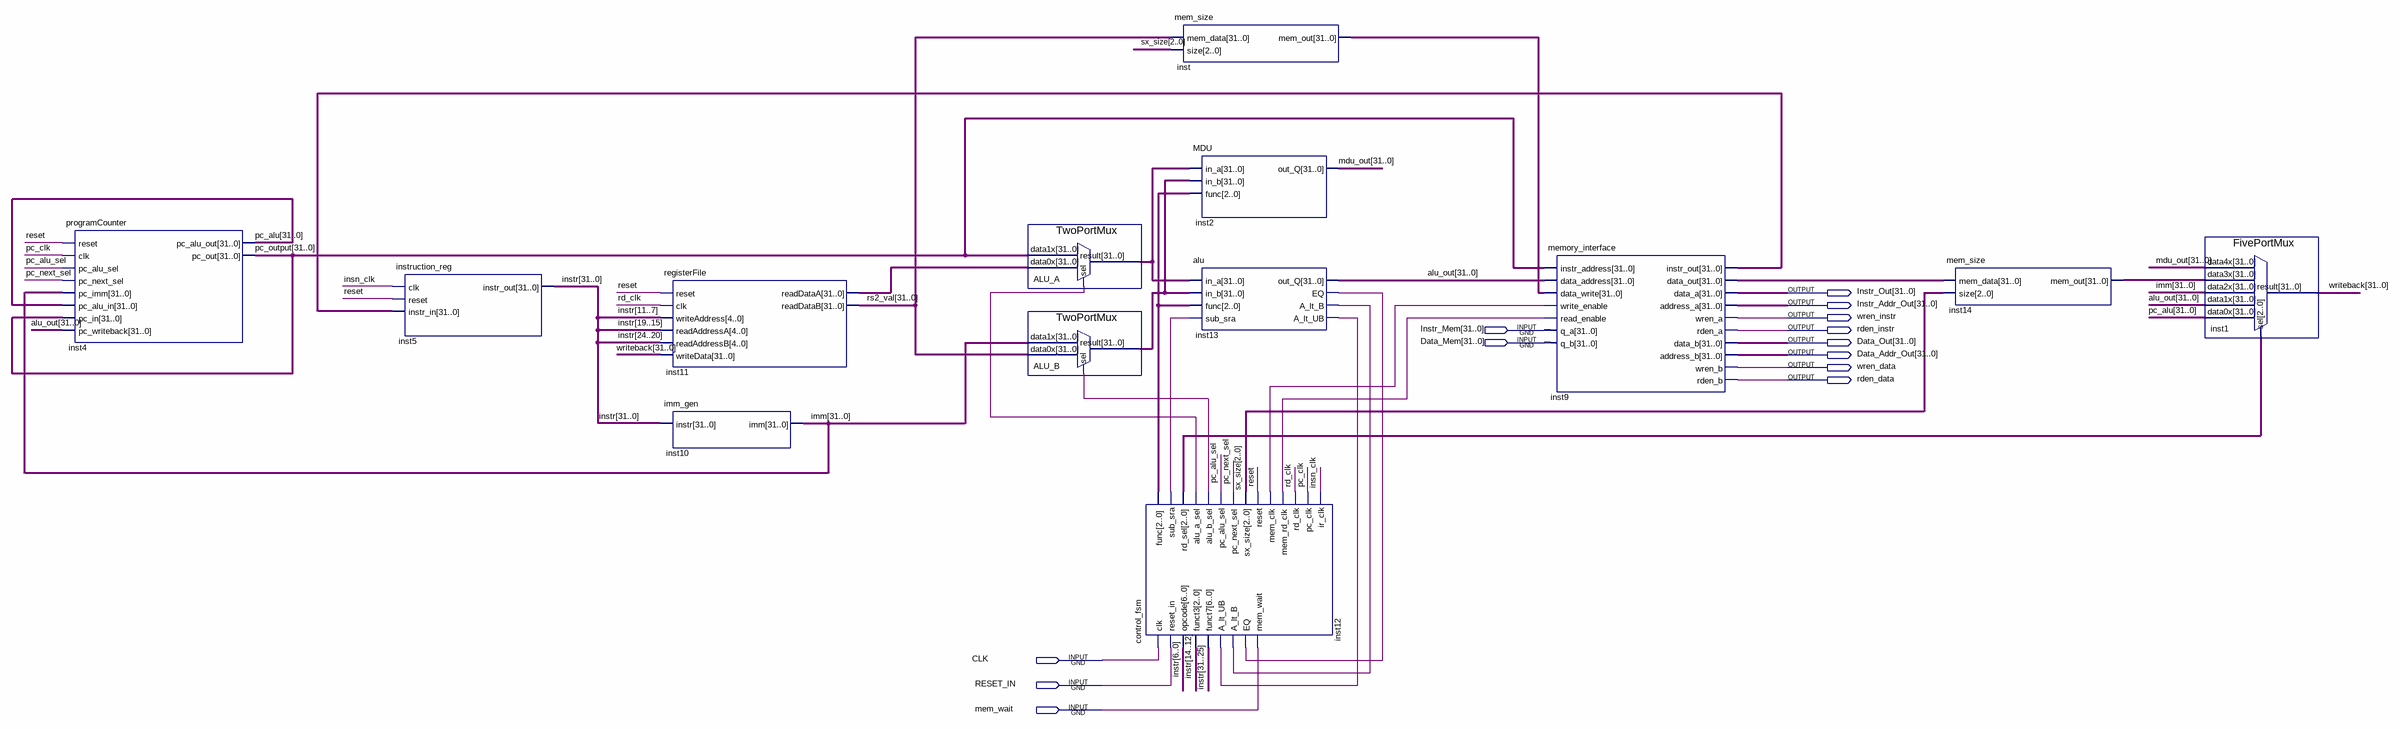
[diagram p0: schematic sheet]
// Quartus schematic NeuroRisc.bdf as structural Verilog: 13 symbols, 13 pins
module NeuroRisc (
  input  [31:0] Instr_Mem,
  input  [31:0] Data_Mem,
  input  CLK,
  input  RESET_IN,
  input  mem_wait,
  output [31:0] Instr_Out,
  output [31:0] Instr_Addr_Out,
  output wren_instr,
  output rden_instr,
  output [31:0] Data_Out,
  output [31:0] Data_Addr_Out,
  output wren_data,
  output rden_data
);

  wire insn_clk, inst12_alu_a_sel, inst12_alu_b_sel, inst12_mem_clk, inst12_mem_rd_clk, inst12_sub_sra,
       inst13_a_lt_b, inst13_a_lt_ub, inst13_eq, pc_alu_sel, pc_clk, pc_next_sel, rd_clk, reset;
  wire [2:0] inst12_func, inst12_rd_sel, sx_size;
  wire [31:0] ALU_A_result, ALU_B_result, alu_out, imm, inst9_data_out, inst9_instr_out, inst11_readdataa,
       inst14_mem_out, inst_mem_out, instr, mdu_out, pc_alu, pc_output, rs2_val, writeback;

  programCounter inst4 (
    .reset(reset), .clk(pc_clk), .pc_alu_sel(pc_alu_sel), .pc_next_sel(pc_next_sel), .pc_imm(imm),
    .pc_alu_in(pc_alu), .pc_in(pc_output), .pc_writeback(alu_out), .pc_alu_out(pc_alu), .pc_out(pc_output));
  instruction_reg inst5 (.clk(insn_clk), .reset(reset), .instr_in(inst9_instr_out), .instr_out(instr));
  registerFile inst11 (
    .reset(reset), .clk(rd_clk), .writeAddress(instr[11:7]), .readAddressA(instr[19:15]),
    .readAddressB(instr[24:20]), .writeData(writeback), .readDataA(inst11_readdataa), .readDataB(rs2_val));
  imm_gen inst10 (.instr(instr), .imm(imm));
  TwoPortMux ALU_A (.data1x(pc_output), .data0x(inst11_readdataa), .sel(inst12_alu_a_sel), .result(ALU_A_result));
  TwoPortMux ALU_B (.data1x(imm), .data0x(rs2_val), .sel(inst12_alu_b_sel), .result(ALU_B_result));
  control_fsm inst12 (
    .clk(CLK), .reset_in(RESET_IN), .opcode(instr[6:0]), .funct3(instr[14:12]), .funct7(instr[31:25]),
    .A_lt_UB(inst13_a_lt_ub), .A_lt_B(inst13_a_lt_b), .EQ(inst13_eq), .mem_wait(mem_wait),
    .func(inst12_func), .sub_sra(inst12_sub_sra), .rd_sel(inst12_rd_sel), .alu_a_sel(inst12_alu_a_sel),
    .alu_b_sel(inst12_alu_b_sel), .pc_alu_sel(pc_alu_sel), .pc_next_sel(pc_next_sel), .sx_size(sx_size),
    .reset(reset), .mem_clk(inst12_mem_clk), .mem_rd_clk(inst12_mem_rd_clk), .rd_clk(rd_clk),
    .pc_clk(pc_clk), .ir_clk(insn_clk));
  mem_size inst (.mem_data(rs2_val), .size(sx_size), .mem_out(inst_mem_out));
  MDU inst2 (.in_a(ALU_A_result), .in_b(ALU_B_result), .func(inst12_func), .out_Q(mdu_out));
  alu inst13 (
    .in_a(ALU_A_result), .in_b(ALU_B_result), .func(inst12_func), .sub_sra(inst12_sub_sra), .out_Q(alu_out),
    .EQ(inst13_eq), .A_lt_B(inst13_a_lt_b), .A_lt_UB(inst13_a_lt_ub));
  memory_interface inst9 (
    .instr_address(pc_output), .data_address(alu_out), .data_write(inst_mem_out),
    .write_enable(inst12_mem_clk), .read_enable(inst12_mem_rd_clk), .q_a(Instr_Mem), .q_b(Data_Mem),
    .instr_out(inst9_instr_out), .data_out(inst9_data_out), .data_a(Instr_Out), .address_a(Instr_Addr_Out),
    .wren_a(wren_instr), .rden_a(rden_instr), .data_b(Data_Out), .address_b(Data_Addr_Out),
    .wren_b(wren_data), .rden_b(rden_data));
  mem_size inst14 (.mem_data(inst9_data_out), .size(sx_size), .mem_out(inst14_mem_out));
  FivePortMux inst1 (
    .data4x(mdu_out), .data3x(inst14_mem_out), .data2x(imm), .data1x(alu_out), .data0x(pc_alu),
    .sel(inst12_rd_sel), .result(writeback));
endmodule
